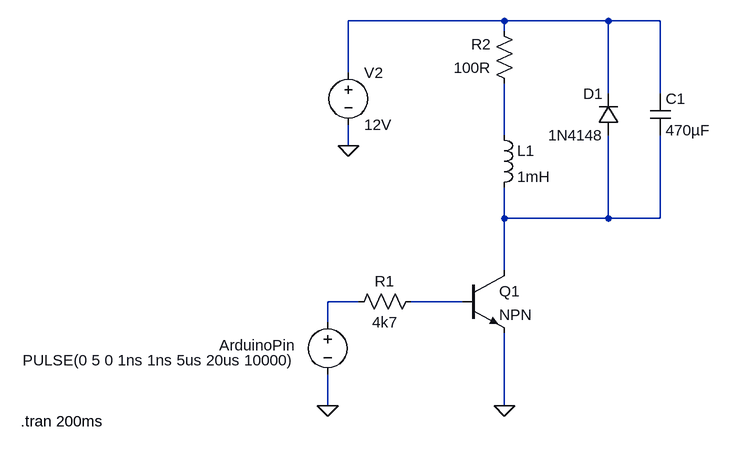
[diagram p0: schematic Motor.asc]
Motor.asc, the LTspice schematic file:
Version 4
SHEET 1 1508 816
WIRE 256 -272 16 -272
WIRE 416 -272 256 -272
WIRE 496 -272 416 -272
WIRE 256 -256 256 -272
WIRE 16 -192 16 -272
WIRE 416 -160 416 -272
WIRE 496 -160 496 -272
WIRE 256 -96 256 -176
WIRE 16 -80 16 -112
WIRE 256 32 256 -16
WIRE 416 32 416 -96
WIRE 416 32 256 32
WIRE 496 32 496 -96
WIRE 496 32 416 32
WIRE 256 112 256 32
WIRE 32 160 -16 160
WIRE 192 160 112 160
WIRE -16 192 -16 160
WIRE -16 320 -16 272
WIRE 256 320 256 208
FLAG -16 320 0
FLAG 16 -80 0
FLAG 256 320 0
SYMBOL voltage -16 176 R0
WINDOW 0 -167 51 Left 2
WINDOW 3 -469 74 Left 2
WINDOW 123 0 0 Left 0
WINDOW 39 0 0 Left 0
SYMATTR InstName ArduinoPin
SYMATTR Value PULSE(0 5 0 1ns 1ns 5us 20us 10000)
SYMBOL res 128 144 R90
WINDOW 0 0 56 VBottom 2
WINDOW 3 32 56 VTop 2
SYMATTR InstName R1
SYMATTR Value 4k7
SYMBOL res 272 -160 R180
WINDOW 0 36 76 Left 2
WINDOW 3 36 40 Left 2
SYMATTR InstName R2
SYMATTR Value 100R
SYMBOL voltage 16 -208 R0
SYMATTR InstName V2
SYMATTR Value 12V
SYMBOL cap 480 -160 R0
SYMATTR InstName C1
SYMATTR Value 470µF
SYMBOL diode 432 -96 R180
WINDOW 0 24 64 Left 2
WINDOW 3 24 0 Left 2
SYMATTR InstName D1
SYMATTR Value 1N4148
SYMBOL ind 240 -112 R0
SYMATTR InstName L1
SYMATTR Value 1mH
SYMBOL npn 192 112 R0
SYMATTR InstName Q1
TEXT -488 344 Left 2 !.tran 200ms

The netlist it stands for:
* Motor.asc
V§ArduinoPin N004 0 PULSE(0 5 0 1ns 1ns 5us 20us 10000)
R1 N005 N004 4k7
R2 N002 N001 100R
V2 N001 0 12V
C1 N001 N003 470µF
D1 N003 N001 1N4148
L1 N002 N003 1mH
Q1 N003 N005 0 0 NPN
.model D D
.lib standard.dio
.model NPN NPN
.model PNP PNP
.lib standard.bjt
.tran 200ms
.backanno
.end